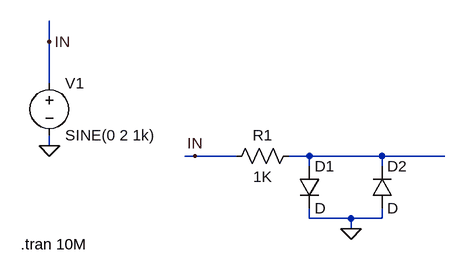
[diagram p0: schematic Limiter.asc]
Limiter.asc, the LTspice schematic file:
Version 4
SHEET 1 880 680
WIRE -32 16 -32 -16
WIRE -32 80 -32 16
WIRE -32 176 -32 160
WIRE 192 192 176 192
WIRE 256 192 192 192
WIRE 368 192 336 192
WIRE 480 192 368 192
WIRE 576 192 480 192
WIRE 368 208 368 192
WIRE 480 208 480 192
WIRE 368 288 368 272
WIRE 432 288 368 288
WIRE 480 288 480 272
WIRE 480 288 432 288
WIRE 432 304 432 288
FLAG -32 176 0
FLAG -32 16 IN
FLAG 192 192 IN
FLAG 432 304 0
SYMBOL voltage -32 64 R0
WINDOW 123 0 0 Left 2
WINDOW 39 0 0 Left 2
SYMATTR InstName V1
SYMATTR Value SINE(0 2 1k)
SYMBOL res 352 176 R90
WINDOW 0 0 56 VBottom 2
WINDOW 3 32 56 VTop 2
SYMATTR InstName R1
SYMATTR Value 1K
SYMBOL diode 352 208 R0
SYMATTR InstName D1
SYMBOL diode 464 272 M180
WINDOW 0 24 64 Left 2
WINDOW 3 24 0 Left 2
SYMATTR InstName D2
TEXT -76 328 Left 2 !.tran 10M

The netlist it stands for:
* Limiter.asc
V1 IN 0 SINE(0 2 1k)
R1 N001 IN 1K
D1 N001 0 D
D2 0 N001 D
.model D D
.lib standard.dio
.tran 10M
.backanno
.end